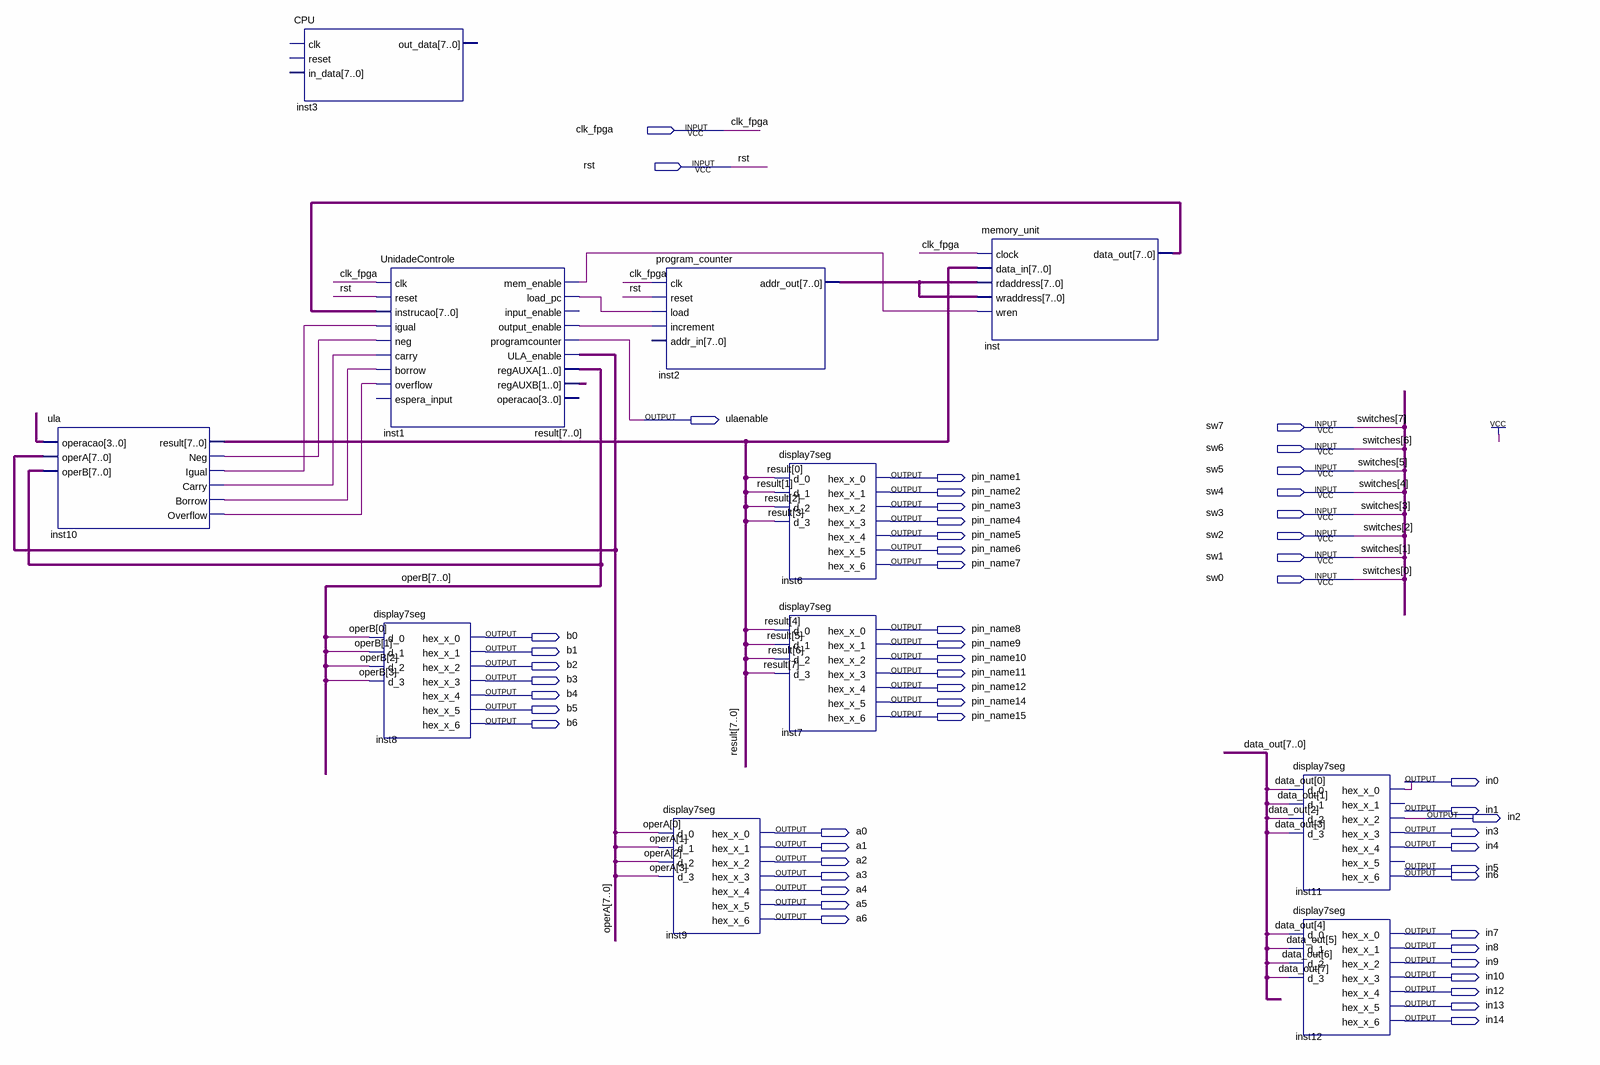
[diagram p0: schematic sheet]
// Quartus schematic computer.bdf as structural Verilog: 11 symbols, 53 pins
module computer (
  input  clk_fpga,
  input  rst,
  input  sw7,
  input  sw6,
  input  sw5,
  input  sw4,
  input  sw3,
  input  sw2,
  input  sw1,
  input  sw0,
  output ulaenable,
  output pin_name1,
  output pin_name2,
  output pin_name3,
  output pin_name4,
  output pin_name5,
  output pin_name6,
  output pin_name7,
  output pin_name8,
  output b0,
  output pin_name9,
  output b1,
  output pin_name10,
  output b2,
  output pin_name11,
  output b3,
  output pin_name12,
  output b4,
  output pin_name14,
  output b5,
  output pin_name15,
  output b6,
  output in0,
  output in1,
  output in2,
  output a0,
  output in3,
  output a1,
  output in4,
  output a2,
  output in5,
  output a3,
  output in6,
  output a4,
  output a5,
  output a6,
  output in7,
  output in8,
  output in9,
  output in10,
  output in12,
  output in13,
  output in14
);

  wire inst1_load_pc, inst1_mem_enable, inst1_output_enable, inst10_borrow, inst10_carry, inst10_igual,
       inst10_neg, inst10_overflow;
  wire [1:0] inst1_regauxb;
  wire [3:0] undriven;
  wire [7:0] data_out, inst2_addr_out, inst_data_out, operA, operB, result;

  ula inst10 (
    .operacao(undriven), .operA(operA), .operB(operB), .result(result), .Neg(inst10_neg),
    .Igual(inst10_igual), .Carry(inst10_carry), .Borrow(inst10_borrow), .Overflow(inst10_overflow));
  CPU inst3 ();  // open: clk, reset, in_data, out_data
  UnidadeControle inst1 (
    .clk(clk_fpga), .reset(rst), .instrucao(inst_data_out), .igual(inst10_igual), .neg(inst10_neg),
    .carry(inst10_carry), .borrow(inst10_borrow), .overflow(inst10_overflow), .mem_enable(inst1_mem_enable),
    .load_pc(inst1_load_pc), .output_enable(inst1_output_enable), .programcounter(ulaenable),
    .ULA_enable(operA), .regAUXA(operB), .regAUXB(inst1_regauxb));  // open: espera_input, input_enable, operacao
  display7seg inst8 (
    .d_0(operB[0]), .d_1(operB[1]), .d_2(operB[2]), .d_3(operB[3]), .hex_x_0(b0), .hex_x_1(b1), .hex_x_2(b2),
    .hex_x_3(b3), .hex_x_4(b4), .hex_x_5(b5), .hex_x_6(b6));
  program_counter inst2 (
    .clk(clk_fpga), .reset(rst), .load(inst1_load_pc), .increment(inst1_output_enable),
    .addr_out(inst2_addr_out));  // open: addr_in
  display7seg inst9 (
    .d_0(operA[0]), .d_1(operA[1]), .d_2(operA[2]), .d_3(operA[3]), .hex_x_0(a0), .hex_x_1(a1), .hex_x_2(a2),
    .hex_x_3(a3), .hex_x_4(a4), .hex_x_5(a5), .hex_x_6(a6));
  display7seg inst6 (
    .d_0(result[0]), .d_1(result[1]), .d_2(result[2]), .d_3(result[3]), .hex_x_0(pin_name1),
    .hex_x_1(pin_name2), .hex_x_2(pin_name3), .hex_x_3(pin_name4), .hex_x_4(pin_name5), .hex_x_5(pin_name6),
    .hex_x_6(pin_name7));
  display7seg inst7 (
    .d_0(result[4]), .d_1(result[5]), .d_2(result[6]), .d_3(result[7]), .hex_x_0(pin_name8),
    .hex_x_1(pin_name9), .hex_x_2(pin_name10), .hex_x_3(pin_name11), .hex_x_4(pin_name12),
    .hex_x_5(pin_name14), .hex_x_6(pin_name15));
  memory_unit inst (
    .clock(clk_fpga), .data_in(result), .rdaddress(inst2_addr_out), .wraddress(inst2_addr_out),
    .wren(inst1_mem_enable), .data_out(inst_data_out));
  display7seg inst11 (
    .d_0(data_out[0]), .d_1(data_out[1]), .d_2(data_out[2]), .d_3(data_out[3]), .hex_x_0(in0), .hex_x_2(in2),
    .hex_x_3(in3), .hex_x_4(in4), .hex_x_6(in6));  // open: hex_x_1, hex_x_5
  display7seg inst12 (
    .d_0(data_out[4]), .d_1(data_out[5]), .d_2(data_out[6]), .d_3(data_out[7]), .hex_x_0(in7), .hex_x_1(in8),
    .hex_x_2(in9), .hex_x_3(in10), .hex_x_4(in12), .hex_x_5(in13), .hex_x_6(in14));

  // Other names for the same wires on the sheet: switches[7:0] = {sw7, sw6, sw5, sw4, sw3, sw2, sw1, sw0}
endmodule
